# EAGLE schematic 8ModuleBoard (EAGLE 6.3)
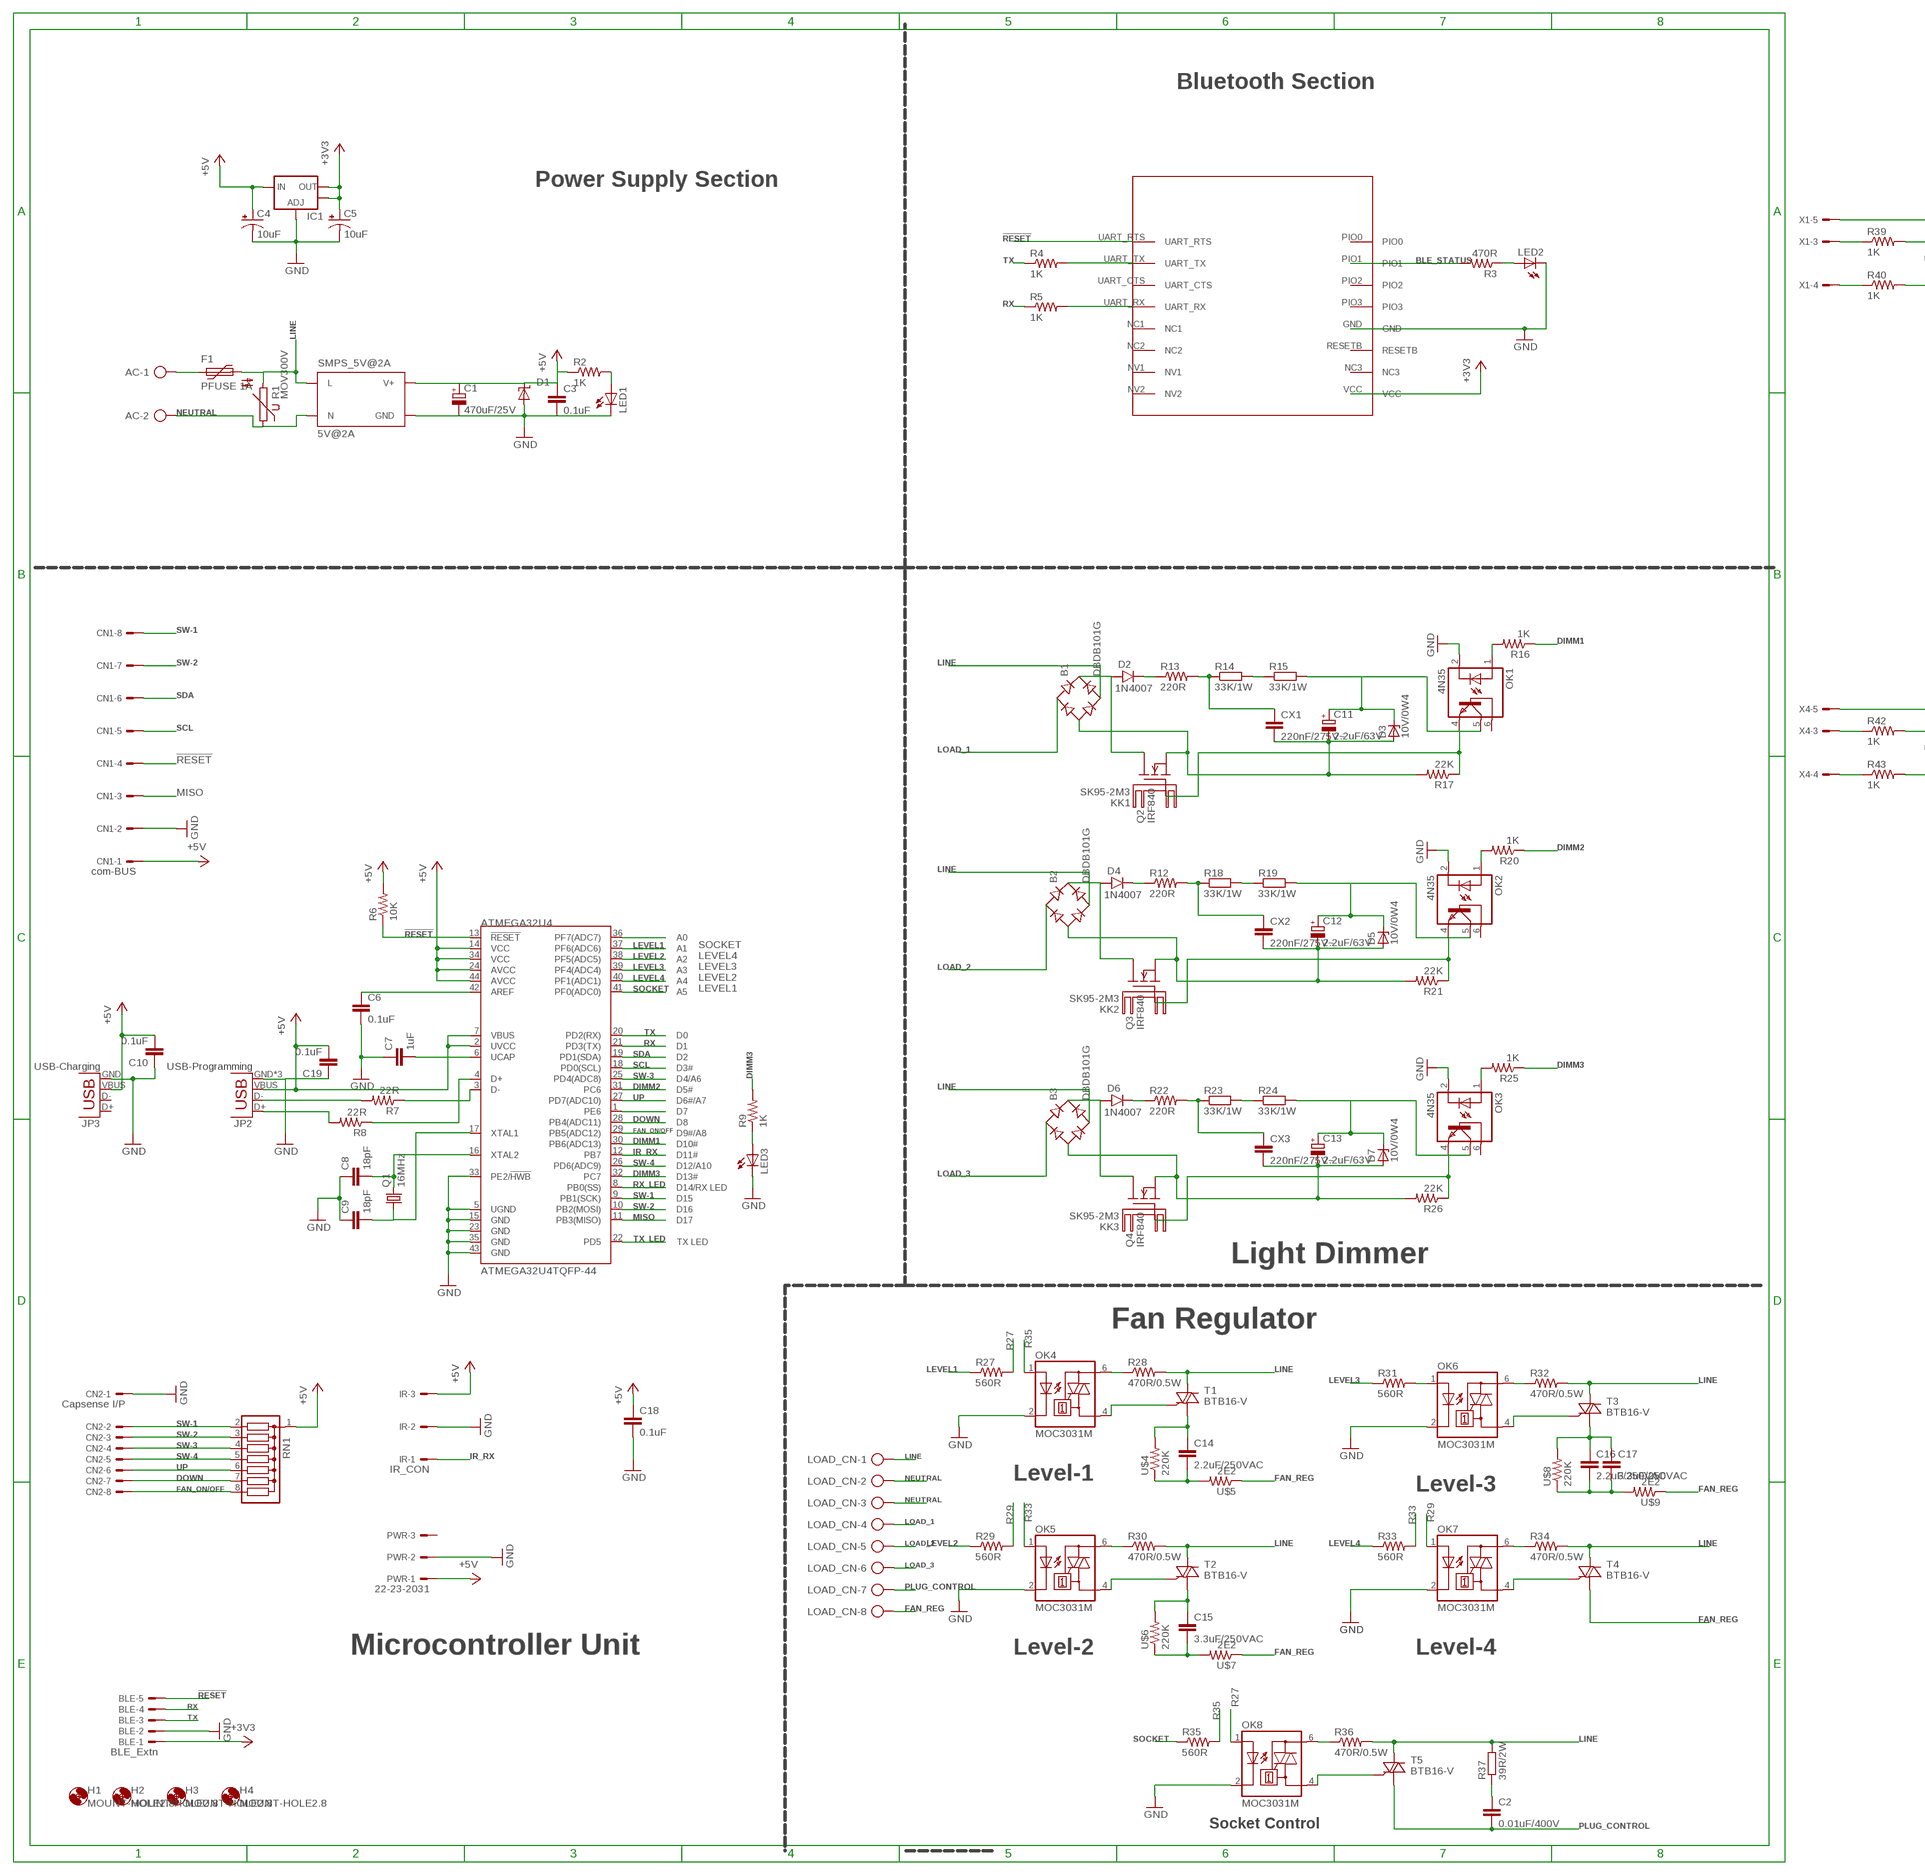
[diagram p0: schematic, sheet 1, part 1 of 2]
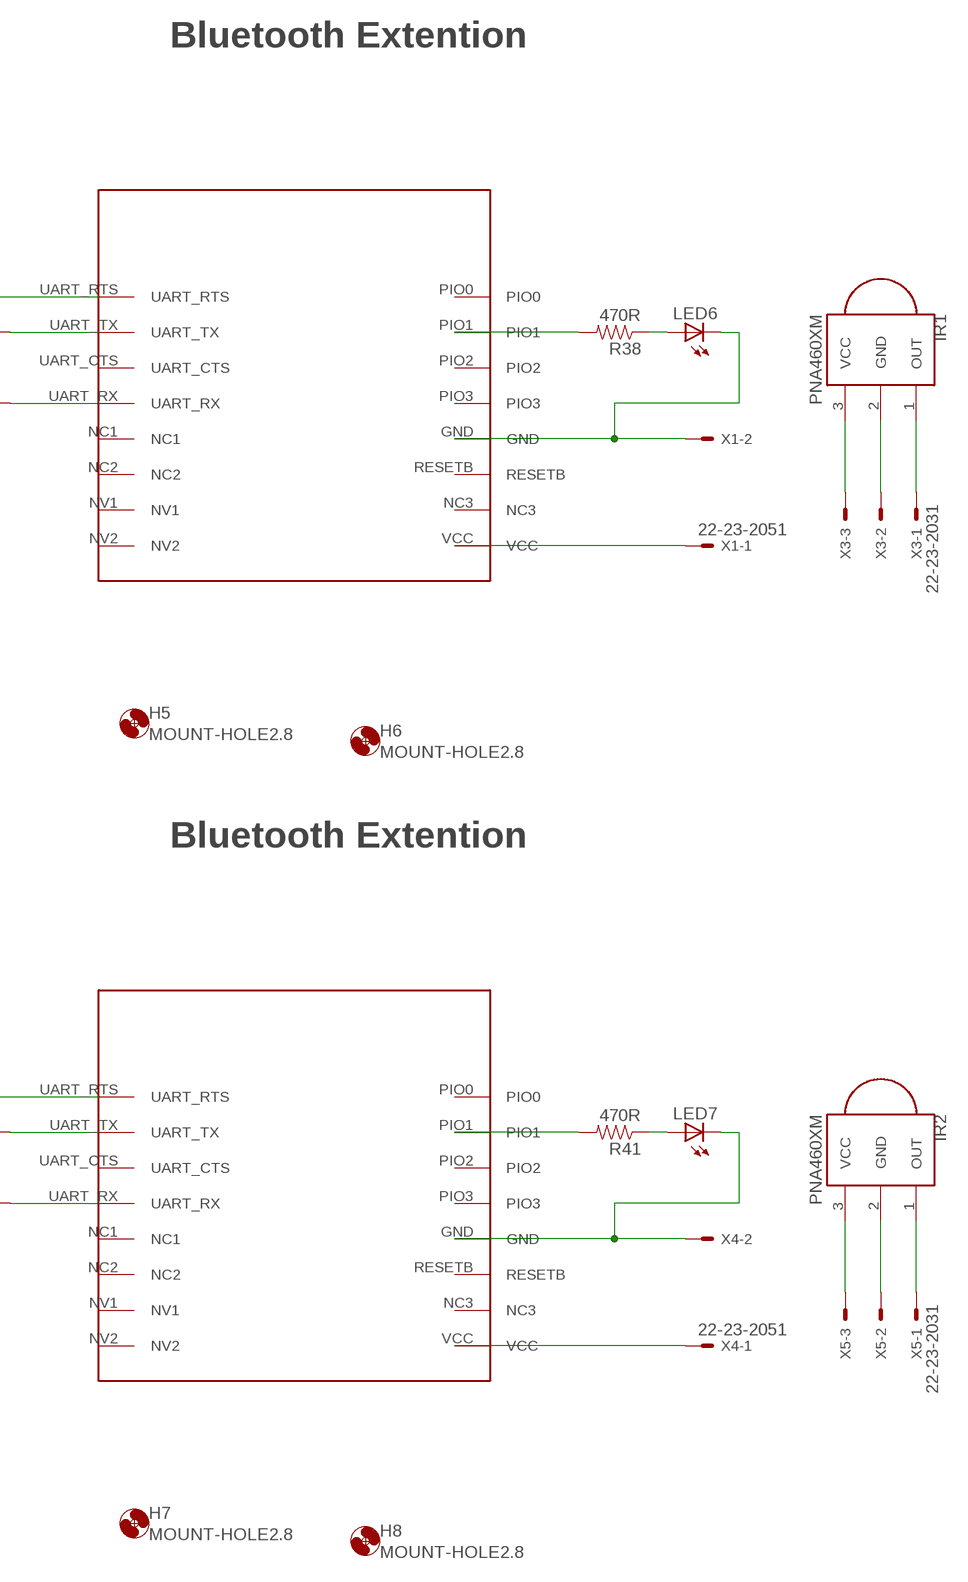
[diagram p1: schematic, sheet 1, part 2 of 2]

## Parts
AC  AK300/2  [AK300/2]
ATMEGA32U4  ATMEGA32U4TQFP-44  [TQFP44]
B1  DBDB101G  [DB]
B2  DBDB101G  [DB]
B3  DBDB101G  [DB]
BLE  BLE_Extn  22-23-2051  [22-23-2051]
C1  470uF/25V  CPOL-EUE5-8.5  [E5-8,5]
C2  0.01uF/400V  C2.5/2  [C2.5-2]
C3  0.1uF  1.0UF50V10%(1206)  [1206]
C4  10uF  10UF-16V-10%(TANT)  [EIA3216]
C5  10uF  10UF-16V-10%(TANT)  [EIA3216]
C6  0.1uF  CAP1206  [1206]
C7  1uF  CAP1206  [1206]
C8  18pF  CAP1206  [1206]
C9  18pF  CAP1206  [1206]
C10  0.1uF  CAP1206  [1206]
C11  2.2uF/63V  CPOL-EUE1.8-4  [E1,8-4]
C12  2.2uF/63V  CPOL-EUE1.8-4  [E1,8-4]
C13  2.2uF/63V  CPOL-EUE1.8-4  [E1,8-4]
C14  2.2uF/250VAC  C27/9  [C27.5B9]
C15  3.3uF/250VAC  C27/9  [C27.5B9]
C16  2.2uF/250VAC  C27/9  [C27.5B9]
C17  3.3uF/250VAC  C27/9  [C27.5B9]
C18  0.1uF  CAP1206  [1206]
C19  0.1uF  CAP1206  [1206]
CN1  com-BUS  22-23-2081  [22-23-2081]
CN2  Capsense I/P  22-23-2081  [22-23-2081]
CX1  220nF/275V~  CXXC15B5  [XC15B5]
CX2  220nF/275V~  CXXC15B5  [XC15B5]
CX3  220nF/275V~  CXXC15B5  [XC15B5]
D1  SUPPRESSOR-SMBJ  [SMBJ]
D2  1N4007  1N400X.1  [DO41-1]
D3  10V/0W4  ZENER-DIODEZD-2.5  [ZDIO-2.5]
D4  1N4007  1N400X.1  [DO41-1]
D5  10V/0W4  ZENER-DIODEZD-2.5  [ZDIO-2.5]
D6  1N4007  1N400X.1  [DO41-1]
D7  10V/0W4  ZENER-DIODEZD-2.5  [ZDIO-2.5]
F1  PFUSE 1A  MF-R055-5,1B  [MF-5,1B]
H1  MOUNT-HOLE2.8  [2,8]
H2  MOUNT-HOLE2.8  [2,8]
H3  MOUNT-HOLE2.8  [2,8]
H4  MOUNT-HOLE2.8  [2,8]
H5  MOUNT-HOLE2.8  [2,8]
H6  MOUNT-HOLE2.8  [2,8]
H7  MOUNT-HOLE2.8  [2,8]
H8  MOUNT-HOLE2.8  [2,8]
IC1  V_REG_LM1117SOT223  [SOT223]
IR  IR_CON  22-23-2031  [22-23-2031]
IR1  PNA460XM  [PNA460XM]
IR2  PNA460XM  [PNA460XM]
JP2  USB-Programming  USB-MICROB  [USB-MICROB]
JP3  USB-Charging  USB-A-H  [USB-A-H]
KK1  SK95-2M3  [SK95-2M3]
KK2  SK95-2M3  [SK95-2M3]
KK3  SK95-2M3  [SK95-2M3]
LED1  LEDSML1206  [SML1206]
LED2  LEDSML1206  [SML1206]
LED3  LEDSML1206  [SML1206]
LED6  LEDSMT1206  [1206]
LED7  LEDSMT1206  [1206]
LOAD_CN  AK300/8  [AK300/8]
OK1  4N35  [DIL06]
OK2  4N35  [DIL06]
OK3  4N35  [DIL06]
OK4  MOC3031M  [DIL06]
OK5  MOC3031M  [DIL06]
OK6  MOC3031M  [DIL06]
OK7  MOC3031M  [DIL06]
OK8  MOC3031M  [DIL06]
PWR  22-23-2031  [22-23-2031]
Q1  16MHz  CRYSTALHC49UP  [HC49UP]
Q2  IRF840  [TO220]
Q3  IRF840  [TO220]
Q4  IRF840  [TO220]
R1  MOV300V  S07K11  [S07K11]
R2  1K  RESISTOR1206  [1206]
R3  470R  RESISTOR1206  [1206]
R4  1K  RESISTOR1206  [1206]
R5  1K  RESISTOR1206  [1206]
R6  10K  RESISTOR1206  [1206]
R7  22R  RESISTOR1206  [1206]
R8  22R  RESISTOR1206  [1206]
R9  1K  RESISTOR1206  [1206]
R12  220R  RESISTOR1206  [1206]
R13  220R  RESISTOR1206  [1206]
R14  33K/1W  R-EU_0411/3V  [0411V]
R15  33K/1W  R-EU_0411/3V  [0411V]
R16  1K  RESISTOR1206  [1206]
R17  22K  RESISTOR1206  [1206]
R18  33K/1W  R-EU_0411/3V  [0411V]
R19  33K/1W  R-EU_0411/3V  [0411V]
R20  1K  RESISTOR1206  [1206]
R21  22K  RESISTOR1206  [1206]
R22  220R  RESISTOR1206  [1206]
R23  33K/1W  R-EU_0411/3V  [0411V]
R24  33K/1W  R-EU_0411/3V  [0411V]
R25  1K  RESISTOR1206  [1206]
R26  22K  RESISTOR1206  [1206]
R27  560R  RESISTOR1206  [1206]
R28  470R/0.5W  R-US_0411/3V  [0411V]
R29  560R  RESISTOR1206  [1206]
R30  470R/0.5W  R-US_0411/3V  [0411V]
R31  560R  RESISTOR1206  [1206]
R32  470R/0.5W  R-US_0411/3V  [0411V]
R33  560R  RESISTOR1206  [1206]
R34  470R/0.5W  R-US_0411/3V  [0411V]
R35  560R  RESISTOR1206  [1206]
R36  470R/0.5W  R-US_0411/3V  [0411V]
R37  39R/2W  R-EU_0411/3V  [0411V]
R38  470R  RESISTOR1206  [1206]
R39  1K  RESISTOR1206  [1206]
R40  1K  RESISTOR1206  [1206]
R41  470R  RESISTOR1206  [1206]
R42  1K  RESISTOR1206  [1206]
R43  1K  RESISTOR1206  [1206]
RN1  G07R  [SIL8]
SMPS_5V@2A  5V@2A  MKS1854-6-0-404  [MKS1854-6-0-404]
T1  BTB16-V  BT138-V  [TO220BV]
T2  BTB16-V  BT138-V  [TO220BV]
T3  BTB16-V  BT138-V  [TO220BV]
T4  BTB16-V  BT138-V  [TO220BV]
T5  BTB16-V  BT138-V  [TO220BV]
U$1  HM-11  [HM-11]
U$3  HM-11  [HM-11]
U$4  220K  RESISTOR1206  [1206]
U$5  2E2  RESISTOR1206  [1206]
U$6  220K  RESISTOR1206  [1206]
U$7  2E2  RESISTOR1206  [1206]
U$8  220K  RESISTOR1206  [1206]
U$9  2E2  RESISTOR1206  [1206]
U$11  HM-11  [HM-11]
X1  22-23-2051  [22-23-2051]
X3  22-23-2031  [22-23-2031]
X4  22-23-2051  [22-23-2051]
X5  22-23-2031  [22-23-2031]

## Nets
!RESET: ATMEGA32U4.13(!RESET) BLE.5 CN1.4 R6.1 U$3.UART_RTS
+3V3: BLE.1 C5.A(+) IC1.2(OUT) IC1.4(OUT) U$3.VCC
+5V: ATMEGA32U4.2(UVCC) ATMEGA32U4.7(VBUS) ATMEGA32U4.14(VCC) ATMEGA32U4.24(AVCC) ATMEGA32U4.34(VCC) ATMEGA32U4.44(AVCC) C1.+ C3.1 C4.A(+) C10.2 C18.1 C19.2 CN1.1 D1.C IC1.3(IN) IR.3 JP2.VBUS JP3.VBUS PWR.1 R2.1 R6.2 RN1.1 SMPS_5V@2A.3(V+)
BGND: IR1.2(GND) LED6.C U$1.GND X1.2 X3.2
BLE_STATUS: R3.2 U$3.PIO1
CGND: IR2.2(GND) LED7.C U$11.GND X4.2 X5.2
DIMM1: ATMEGA32U4.30(PB6(ADC13)) R16.1
DIMM2: ATMEGA32U4.31(PC6) R20.1
DIMM3: ATMEGA32U4.32(PC7) R9.2 R25.1
DOWN: ATMEGA32U4.28(PB4(ADC11)) CN2.7 RN1.7
FAN_ON/OFF: ATMEGA32U4.29(PB5(ADC12)) CN2.8 RN1.8
FAN_REG: LOAD_CN.8 T4.T1(A1) U$5.1 U$7.1 U$9.1
GND: ATMEGA32U4.5(UGND) ATMEGA32U4.15(GND) ATMEGA32U4.23(GND) ATMEGA32U4.33(PE2/!HWB) ATMEGA32U4.35(GND) ATMEGA32U4.43(GND) BLE.2 C1.- C3.2 C4.C(-) C5.C(-) C6.2 C7.1 C8.1 C9.1 C10.1 C18.2 C19.1 CN1.2 CN2.1 D1.A IC1.1(ADJ) IR.2 JP2.GND JP2.MT1(GND) JP2.MT2(GND) JP3.GND LED1.C LED2.C LED3.C OK1.2(C) OK2.2(C) OK3.2(C) OK4.2(C) OK5.2(C) OK6.2(C) OK7.2(C) OK8.2(C) PWR.2 SMPS_5V@2A.4(GND) U$3.GND
IR_RX: ATMEGA32U4.12(PB7) IR.1
LEVEL1: ATMEGA32U4.37(PF6(ADC6)) R27.1
LEVEL2: ATMEGA32U4.38(PF5(ADC5)) R29.1
LEVEL3: ATMEGA32U4.39(PF4(ADC4)) R31.1
LEVEL4: ATMEGA32U4.40(PF1(ADC1)) R33.1
LINE: B1.AC2 B2.AC2 B3.AC2 F1.2 LOAD_CN.1 R1.2 R28.2 R30.2 R32.2 R34.2 R36.2 R37.2 SMPS_5V@2A.1(L) T1.T2(A2) T2.T2(A2) T3.T2(A2) T4.T2(A2) T5.T2(A2)
LOAD_1: B1.AC1 LOAD_CN.4
LOAD_2: B2.AC1 LOAD_CN.5
LOAD_3: B3.AC1 LOAD_CN.6
MISO: ATMEGA32U4.11(PB3(MISO)) CN1.3
N$1: OK6.1(A) R31.2
N$2: B2.- C12.- CX2.2 D5.A Q3.3(S) R21.2
N$3: R39.2 U$1.UART_TX
N$4: R4.2 U$3.UART_TX
N$5: LED3.A R9.1
N$7: ATMEGA32U4.6(UCAP) C7.2
N$9: LED2.A R3.1
N$10: ATMEGA32U4.42(AREF) C6.1
N$11: R5.2 U$3.UART_RX
N$12: R40.2 U$1.UART_RX
N$13: B1.- C11.- CX1.2 D3.A Q2.3(S) R17.2
N$14: D2.C R13.1
N$15: LED1.A R2.2
N$16: JP2.D- R7.2
N$17: JP2.D+ R8.2
N$18: ATMEGA32U4.3(D-) R7.1
N$19: ATMEGA32U4.4(D+) R8.1
N$20: CX1.1 R13.2 R14.1
N$21: R14.2 R15.1
N$22: ATMEGA32U4.16(XTAL2) C8.2 Q1.2
N$23: ATMEGA32U4.17(XTAL1) C9.2 Q1.1
N$24: OK1.1(A) R16.2
N$25: C11.+ D3.C OK1.5(COL) R15.2
N$26: R38.2 U$1.PIO1
N$27: C2.1 R37.1
N$28: OK1.4(EMI) Q2.1(G) R17.1
N$29: D4.C R12.1
N$30: CX2.1 R12.2 R18.1
N$31: ATMEGA32U4.1(PE6)
N$32: B1.+ D2.A Q2.2(D)
N$33: R18.2 R19.1
N$34: C12.+ D5.C OK2.5(COL) R19.2
N$35: OK2.1(A) R20.2
N$36: AC.1 F1.1
N$37: OK2.4(EMI) Q3.1(G) R21.1
N$38: B2.+ D4.A Q3.2(D)
N$39: LED6.A R38.1
N$40: U$1.UART_RTS X1.5
N$41: B3.- C13.- CX3.2 D7.A Q4.3(S) R26.2
N$42: D6.C R22.1
N$43: CX3.1 R22.2 R23.1
N$44: ATMEGA32U4.36(PF7(ADC7))
N$45: R23.2 R24.1
N$46: C13.+ D7.C OK3.5(COL) R24.2
N$47: OK3.1(A) R25.2
N$48: R40.1 X1.4
N$49: OK3.4(EMI) Q4.1(G) R26.1
N$50: B3.+ D6.A Q4.2(D)
N$51: R39.1 X1.3
N$52: OK4.6(A2) R28.1
N$54: OK4.4(A1) T1.G
N$55: C14.1 T1.T1(A1) U$4.2
N$56: C14.2 U$4.1 U$5.2
N$57: U$1.VCC X1.1
N$60: OK5.6(A2) R30.1
N$61: IR1.1(OUT) X3.1
N$62: OK5.4(A1) T2.G
N$63: C15.1 T2.T1(A1) U$6.2
N$64: C15.2 U$6.1 U$7.2
N$67: IR1.3(VCC) X3.3
N$68: OK6.6(A2) R32.1
N$70: OK6.4(A1) T3.G
N$71: C16.1 C17.1 T3.T1(A1) U$8.2
N$72: C16.2 C17.2 U$8.1 U$9.2
N$76: OK7.6(A2) R34.1
N$78: OK7.4(A1) T4.G
N$82: OK8.6(A2) R36.1
N$84: OK8.4(A1) T5.G
N$85: R42.2 U$11.UART_TX
N$86: R43.2 U$11.UART_RX
N$87: R41.2 U$11.PIO1
N$88: LED7.A R41.1
N$89: U$11.UART_RTS X4.5
N$90: R43.1 X4.4
N$91: R42.1 X4.3
N$93: U$11.VCC X4.1
N$94: IR2.1(OUT) X5.1
N$96: IR2.3(VCC) X5.3
NEUTRAL: AC.2 LOAD_CN.2 LOAD_CN.3 R1.1 SMPS_5V@2A.2(N)
PLUG_CONTROL: C2.2 LOAD_CN.7 T5.T1(A1)
R27: OK8.1(A) R27.2
R29: OK7.1(A) R29.2
R33: OK5.1(A) R33.2
R35: OK4.1(A) R35.2
RX: ATMEGA32U4.21(PD3(TX)) BLE.4 R5.1
RX_LED: ATMEGA32U4.8(PB0(SS))
SCL: ATMEGA32U4.18(PD0(SCL)) CN1.5
SDA: ATMEGA32U4.19(PD1(SDA)) CN1.6
SOCKET: ATMEGA32U4.41(PF0(ADC0)) R35.1
SW-1: ATMEGA32U4.9(PB1(SCK)) CN1.8 CN2.2 RN1.2
SW-2: ATMEGA32U4.10(PB2(MOSI)) CN1.7 CN2.3 RN1.3
SW-3: ATMEGA32U4.25(PD4(ADC8)) CN2.4 RN1.4
SW-4: ATMEGA32U4.26(PD6(ADC9)) CN2.5 RN1.5
TX: ATMEGA32U4.20(PD2(RX)) BLE.3 R4.1
TX_LED: ATMEGA32U4.22(PD5)
UP: ATMEGA32U4.27(PD7(ADC10)) CN2.6 RN1.6
Unconnected: JP3.D+ JP3.D- OK1.6(BAS) OK2.6(BAS) OK3.6(BAS) PWR.3 U$1.NC1 U$1.NC2 U$1.NC3 U$1.NV1 U$1.NV2 U$1.PIO0 U$1.PIO2 U$1.PIO3 U$1.RESETB U$1.UART_CTS U$3.NC1 U$3.NC2 U$3.NC3 U$3.NV1 U$3.NV2 U$3.PIO0 U$3.PIO2 U$3.PIO3 U$3.RESETB U$3.UART_CTS U$11.NC1 U$11.NC2 U$11.NC3 U$11.NV1 U$11.NV2 U$11.PIO0 U$11.PIO2 U$11.PIO3 U$11.RESETB U$11.UART_CTS

## Notes on the sheet
- Bluetooth Extention
- Bluetooth Section
- Power Supply Section
- Bluetooth Extention
- SOCKET
- LEVEL4
- LEVEL3
- LEVEL2
- LEVEL1
- Light Dimmer
- Fan Regulator
- Level-1
- Level-3
- Microcontroller Unit | Level-2 | Level-4
- Socket Control

## Library data of the parts
AC = con-ptr500:AK300/2: CONNECTOR; OC_FARNELL: unknown; OC_NEWARK: unknown
ATMEGA32U4 = SparkFun-DigitalIC:ATMEGA32U4: Atmel 44-pin 8-bit Microcontroller with 32KBytes of ISP Flash and USB Controller
B1-B3 = rectifier:DB?*G: Single Phase 1.0 AMP Glass Passivated Bridge Rectifier Taiwan Semiconductor Co.,Ltd. - TSC Source: http://www.taiwansemi.com/TSCbig5/ezcatfiles/cust/img/img/db101g.pdf http://www.ts.com.tw/db/pictures/modules/PDT/PDT060207001/DBLS201G.pdf
BLE X1 X4 = con-molex:22-23-2051: .100" (2.54mm) Center Header - 5 Pin; MF: MOLEX; MPN: 22-23-2051; OC_FARNELL: 1462952; OC_NEWARK: 38C9178
C1 C11-C13 = rcl:CPOL-EU: POLARIZED CAPACITOR, European symbol
C2 C14-C17 = capacitor-wima:C: CAPACITOR naming: grid - package width
C3 = SparkFun-Capacitors:1.0UF50V10%(1206): CAP-09822; PROD_ID: CAP-09822; VALUE: 1.0uF
C4 C5 = SparkFun-Capacitors:10UF-16V-10%(TANT): CAP-00811 1206/EIA-3216 Tantalum capacitor; PROD_ID: CAP-00811
C6-C10 C18 C19 = SparkFun-Passives:CAP: Capacitor Standard 0603 ceramic capacitor, and 0.1" leaded capacitor.
CN1 CN2 = con-molex:22-23-2081: .100" (2.54mm) Center Header - 8 Pin; MF: MOLEX; MPN: 22-23-2081; OC_FARNELL: 1756826; OC_NEWARK: 01C7592
CX1-CX3 = rcl:CX: X CAPACITOR for power line
D1 = diode:SUPPRESSOR-: Suppressor diode
D2 D4 D6 = gm-diodes:1N400X: Rectifier Diodes often used in power supply to prevent damage from reverse polarization
D3 D5 D7 = diode:ZENER-DIODE: Z-Diode
F1 = bourns:MF-R055: MultiFuse Polyfuse Overcurrent Protectors
H1-H8 = holes:MOUNT-HOLE: MOUNTING HOLE with drill center marker
IC1 = SparkFun-PowerIC:V_REG_LM1117: Voltage Regulator LM1117 Standard adjustable voltage regulator but in SMD form. Spark Fun Electronics SKU : COM-00595; PROD_ID: VREG-08170
IR PWR X3 X5 = con-molex:22-23-2031: .100" (2.54mm) Center Header - 3 Pin; MF: MOLEX; MPN: 22-23-2031; OC_FARNELL: 1462950; OC_NEWARK: 30C0862
IR1 IR2 = adafruit:PNA460XM: IR 38KHz receiver PNA4602 and related receivers http://www.ladyada.net/library/pcb/eaglelibrary.html
JP2 = SparkFun-Connectors:USB: USB Connectors USB-B-PTH is fully proven SKU : PRT-00139/CONN-08278 USB-miniB is fully proven SKU : PRT-00587 USB-A-PCB is untested. USB-A-H is throughly reviewed, but untested. Spark Fun Electronics SKU : PRT-00437 USB-B-SMT is throughly reviewed, but untested. Needs silkscreen touching up. USB-A-S has not been used/tested USB-MB-H has not been used/tested USB-MICROB has been used. CONN-09505; PROD_ID: CONN-09505
JP3 = SparkFun-Connectors:USB: USB Connectors USB-B-PTH is fully proven SKU : PRT-00139/CONN-08278 USB-miniB is fully proven SKU : PRT-00587 USB-A-PCB is untested. USB-A-H is throughly reviewed, but untested. Spark Fun Electronics SKU : PRT-00437 USB-B-SMT is throughly reviewed, but untested. Needs silkscreen touching up. USB-A-S has not been used/tested USB-MB-H has not been used/tested USB-MICROB has been used. CONN-09505; PROD_ID: CONN-08367
KK1-KK3 = heatsink:SK95-2M3: HEATSINK manufacturer Fischer/distributor Buerklin
LED1-LED3 LED6 LED7 = led:LED: LED OSRAM: - CHIPLED LG R971, LG N971, LY N971, LG Q971, LY Q971, LO R971, LY R971 LH N974, LH R974 LS Q976, LO Q976, LY Q976 LO Q996 - Hyper CHIPLED LW Q18S LB Q993, LB Q99A, LB R99A - SideLED LS A670, LO A670, LY A670, LG A670, LP A670 LB A673, LV A673, LT A673, LW A673 LH A674 LY A675 LS A676, LA A676, LO A676, LY A676, LW A676 LS A679, LY A679, LG A679 - Hyper Micro SIDELED® LS Y876, LA Y876, LO Y876, LY Y876 LT Y87S - SmartLED LW L88C, LW L88S LB L89C, LB L89S, LG L890 LS L89K, LO L89K, LY L89K LS L896, LA L896, LO L896, LY L896 - TOPLED LS T670, LO T670, LY T670, LG T670, LP T670 LSG T670, LSP T670, LSY T670, LOP T670, LYG T670 LG T671, LOG T671, LSG T671 LB T673, LV T673, LT T673, LW T673 LH T674 LS T676, LA T676, LO T676, LY T676, LB T676, LH T676, LSB T676, LW T676 LB T67C, LV T67C, LT T67C, LS T67K, LO T67K, LY T67K, LW E67C LS E67B, LA E67B, LO E67B, LY E67B, LB E67C, LV E67C, LT E67C LW T67C LS T679, LY T679, LG T679 LS T770, LO T770, LY T770, LG T770, LP T770 LB T773, LV T773, LT T773, LW T773 LH T774 LS E675, LA E675, LY E675, LS T675 LS T776, LA T776, LO T776, LY T776, LB T776 LHGB T686 LT T68C, LB T68C - Hyper Mini TOPLED® LB M676 - Mini TOPLED Santana® LG M470 LS M47K, LO M47K, LY M47K Source: http://www.osram.convergy.de LUXEON: - LUMILED® LXK2-PW12-R00, LXK2-PW12-S00, LXK2-PW14-U00, LXK2-PW14-V00 LXK2-PM12-R00, LXK2-PM12-S00, LXK2-PM14-U00 LXK2-PE12-Q00, LXK2-PE12-R00, LXK2-PE12-S00, LXK2-PE14-T00, LXK2-PE14-U00 LXK2-PB12-K00, LXK2-PB12-L00, LXK2-PB12-M00, LXK2-PB14-N00, LXK2-PB14-P00, LXK2-PB14-Q00 LXK2-PR12-L00, LXK2-PR12-M00, LXK2-PR14-Q00, LXK2-PR14-R00 LXK2-PD12-Q00, LXK2-PD12-R00, LXK2-PD12-S00 LXK2-PH12-R00, LXK2-PH12-S00 LXK2-PL12-P00, LXK2-PL12-Q00, LXK2-PL12-R00 Source: www.luxeon.com KINGBRIGHT: KA-3528ASYC Source: www.kingbright.com
LOAD_CN = con-ptr500:AK300/8: CONNECTOR; OC_FARNELL: unknown; OC_NEWARK: unknown
OK1-OK3 = optocoupler:4N35: MOTOROLA OPTO COUPLER; MF: FAIRCHILD SEMICONDUCTOR; MPN: 4N35; OC_FARNELL: 1328375; OC_NEWARK: 72K9946
OK4-OK8 = optocoupler:MOC30*: 6-Pin DIP Zero-Cross Optoisolators Triac Driver Output (250/400 Volt Peak) Source: Data sheet <http://www.fairchildsemi.com/ds/MO/MOC3031M.pdf> The old path of data sheet not more available 2013-05-06.; MF: FAIRCHILD SEMICONDUCTOR; MPN: MOC3031M; OC_FARNELL: 9875964; OC_NEWARK: 78K6089
Q1 = crystal:CRYSTAL: CRYSTAL; OC_FARNELL: unknown; OC_NEWARK: unknown
Q2-Q4 = transistor-fet:IRF840: N-Channel Enhancement MOSFET (HEXFET); 500V; 8A; 0,85Ohm
R1 = varistor:S07K11: VARISTOR
R2 R4 R5 R12 R13 R22 R27 R29 R31 R33 R35 R39 R40 R42 R43 U$4-U$9 = SparkFun-Resistors:RESISTOR: Resistor Basic schematic elements and footprints for 0603, 1206, and PTH resistors.
R3 R6-R9 R16 R17 R20 R21 R25 R26 R38 R41 = SparkFun-Passives:RESISTOR: Resistor Basic schematic elements and footprints for 0603, 1206, and PTH resistors.
R14 R15 R18 R19 R23 R24 R37 = rcl:R-EU_: RESISTOR, European symbol
R28 R30 R32 R34 R36 = rcl:R-US_: RESISTOR, American symbol
RN1 = resistor-sil:G07R: SIL RESISTOR; OC_FARNELL: unknown; OC_NEWARK: unknown
SMPS_5V@2A = Morsun-con-stocko:MKS1854-6-0-404: Serie MKS 1850 Lötstifte In-line, Raster 2.5 mm, Stiftwannen, stehend, mit Rastlasche Source: http://www.stocko.de/de/index.php?seite=ka_rfk2_mks1850.html&rubrik=Katalog+-+RFK+2 rfk_1850.pdf; OC_FARNELL: 1141862; OC_NEWARK: unknown
T1-T5 = triac:BT138: TRIAC Source: http://www.semiconductors.philips.com BT138_SERIES_2.pdf
U$1 U$3 U$11 = HM-11:HM-11